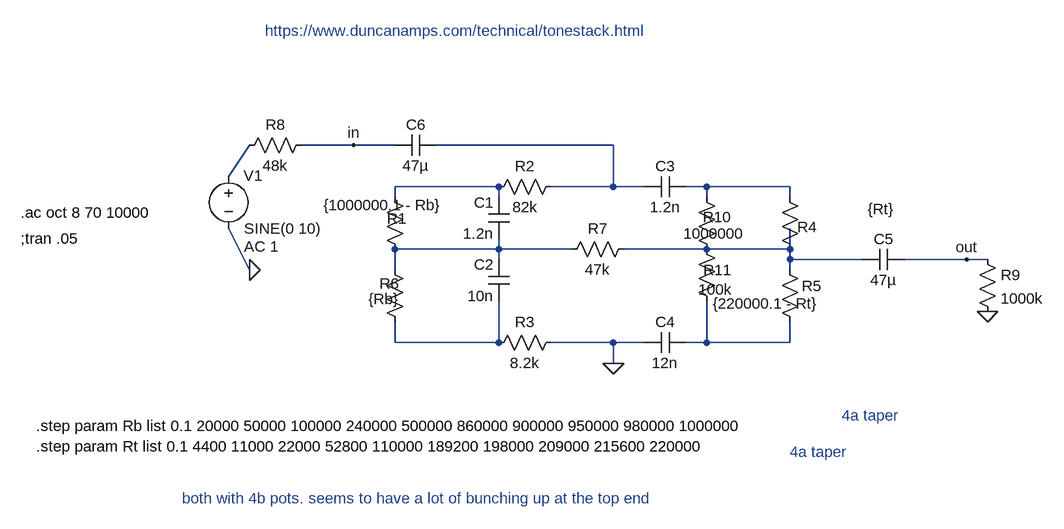
[diagram p0: schematic tone_v008_baxandall_5_duncan.asc]
tone_v008_baxandall_5_duncan.asc, the LTspice schematic file:
Version 4
SHEET 1 1168 680
WIRE 96 80 16 80
WIRE 160 80 96 80
WIRE 496 80 224 80
WIRE -96 128 -64 80
WIRE 320 144 160 144
WIRE 496 144 496 80
WIRE 496 144 400 144
WIRE 544 144 496 144
WIRE 640 144 608 144
WIRE 768 144 640 144
WIRE 160 160 160 144
WIRE 320 160 320 144
WIRE 640 160 640 144
WIRE 768 160 768 144
WIRE 320 240 320 224
WIRE 320 240 160 240
WIRE 432 240 320 240
WIRE 640 240 512 240
WIRE 768 240 768 208
WIRE 768 240 640 240
WIRE 320 256 320 240
WIRE 768 256 768 240
WIRE 880 256 768 256
WIRE 1040 256 944 256
WIRE 1072 256 1040 256
WIRE -64 272 -96 208
WIRE 160 272 160 240
WIRE 768 272 768 256
WIRE 160 384 160 352
WIRE 320 384 320 320
WIRE 320 384 160 384
WIRE 496 384 400 384
WIRE 544 384 496 384
WIRE 640 384 640 320
WIRE 640 384 608 384
WIRE 768 384 768 352
WIRE 768 384 640 384
WIRE 496 416 496 384
FLAG -64 272 0
FLAG 496 416 0
FLAG 1040 256 out
FLAG 96 80 in
FLAG 1072 336 0
SYMBOL voltage -96 112 R0
WINDOW 123 24 124 Left 2
WINDOW 39 0 0 Left 0
WINDOW 0 23 15 Left 2
SYMATTR Value2 AC 1
SYMATTR InstName V1
SYMATTR Value SINE(0 10)
SYMBOL res 416 128 R90
WINDOW 0 0 56 VBottom 2
WINDOW 3 32 56 VTop 2
SYMATTR InstName R2
SYMATTR Value 82k
SYMBOL res 416 368 R90
WINDOW 0 0 56 VBottom 2
WINDOW 3 32 56 VTop 2
SYMATTR InstName R3
SYMATTR Value 8.2k
SYMBOL res 784 256 R180
WINDOW 0 -26 50 Left 2
WINDOW 3 -144 78 Left 2
SYMATTR InstName R4
SYMATTR Value {Rt}
SYMBOL res 784 368 R180
WINDOW 0 -33 71 Left 2
WINDOW 3 -29 44 Left 2
SYMATTR InstName R5
SYMATTR Value {220000.1 - Rt}
SYMBOL res 144 144 R0
WINDOW 3 -94 28 Left 2
WINDOW 0 4 49 Left 2
SYMATTR Value {1000000.1 - Rb}
SYMATTR InstName R1
SYMBOL res 144 256 R0
WINDOW 3 -25 61 Left 2
WINDOW 0 -8 37 Left 2
SYMATTR Value {Rb}
SYMATTR InstName R6
SYMBOL cap 336 224 R180
WINDOW 0 24 56 Left 2
WINDOW 3 24 8 Left 2
SYMATTR InstName C1
SYMATTR Value 1.2n
SYMBOL cap 336 320 R180
WINDOW 0 24 56 Left 2
WINDOW 3 24 8 Left 2
SYMATTR InstName C2
SYMATTR Value 10n
SYMBOL cap 608 128 R90
WINDOW 0 0 32 VBottom 2
WINDOW 3 32 32 VTop 2
SYMATTR InstName C3
SYMATTR Value 1.2n
SYMBOL cap 608 368 R90
WINDOW 0 0 32 VBottom 2
WINDOW 3 32 32 VTop 2
SYMATTR InstName C4
SYMATTR Value 12n
SYMBOL res 528 224 R90
WINDOW 0 0 56 VBottom 2
WINDOW 3 32 56 VTop 2
SYMATTR InstName R7
SYMATTR Value 47k
SYMBOL res 32 64 R90
WINDOW 0 0 56 VBottom 2
WINDOW 3 32 56 VTop 2
SYMATTR InstName R8
SYMATTR Value 48k
SYMBOL res 1056 240 R0
SYMATTR InstName R9
SYMATTR Value 1000k
SYMBOL res 624 144 R0
WINDOW 0 10 47 Left 2
WINDOW 3 -20 72 Left 2
SYMATTR InstName R10
SYMATTR Value 1000000
SYMBOL res 624 224 R0
WINDOW 0 11 48 Left 2
WINDOW 3 3 78 Left 2
SYMATTR InstName R11
SYMATTR Value 100k
SYMBOL cap 944 240 R90
WINDOW 0 0 32 VBottom 2
WINDOW 3 32 32 VTop 2
SYMATTR InstName C5
SYMATTR Value 47µ
SYMBOL cap 224 64 R90
WINDOW 0 0 32 VBottom 2
WINDOW 3 32 32 VTop 2
SYMATTR InstName C6
SYMATTR Value 47µ
TEXT -416 224 Left 2 !;tran .05
TEXT -416 184 Left 2 !.ac oct 8 70 10000
TEXT -392 512 Left 2 !.step param Rb list 0.1 20000 50000 100000 240000 500000 860000 900000 950000 980000 1000000
TEXT -392 544 Left 2 !.step param Rt list 0.1 4400 11000 22000 52800 110000 189200 198000 209000 215600 220000
TEXT -40 -96 Left 2 ;https://www.duncanamps.com/technical/tonestack.html
TEXT -168 624 Left 2 ;both with 4b pots. seems to have a lot of bunching up at the top end
TEXT 848 496 Left 2 ;4a taper
TEXT 768 552 Left 2 ;4a taper

The netlist it stands for:
* tone_v008_baxandall_5_duncan.asc
V1 N002 0 SINE(0 10) AC 1
R2 N001 N003 82k
R3 0 N007 8.2k
R4 N006 N004 {Rt}
R5 N008 N006 {220000.1 - Rt}
R1 N003 N005 {1000000.1 - Rb}
R6 N005 N007 {Rb}
C1 N005 N003 1.2n
C2 N007 N005 10n
C3 N004 N001 1.2n
C4 N008 0 12n
R7 N006 N005 47k
R8 in N002 48k
R9 out 0 1000k
R10 N004 N006 1000000
R11 N006 N008 100k
C5 out N006 47µ
C6 N001 in 47µ
;tran .05
.ac oct 8 70 10000
.step param Rb list 0.1 20000 50000 100000 240000 500000 860000 900000 950000 980000 1000000
.step param Rt list 0.1 4400 11000 22000 52800 110000 189200 198000 209000 215600 220000
* https://www.duncanamps.com/technical/tonestack.html
* both with 4b pots. seems to have a lot of bunching up at the top end
* 4a taper
* 4a taper
.backanno
.end